# Altium schematic sheet 4_Channel_TVS_alternative.SchDoc
size A4; CompanyName: Technische Hochschule Nürnberg Georg Simon Ohm; Organization: UltraZohm; Address1: Kesslerplatz 12; Address2: 90489 Nürnberg; Address3: GERMANY; SheetNumber: 26; SheetTotal: 36; Website: www.ultrazohm.com
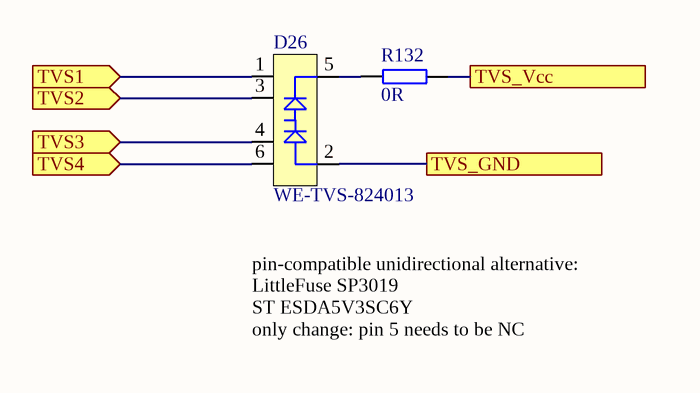
[diagram p0: 4_Channel_TVS_alternative.SchDoc]

## Parts
D26  WE-TVS-824013  [SOT95P280X145-6N]
R132  0R  [RESC1608X55N_V]

## Ports
TVS1 (in), TVS2 (in), TVS3 (in), TVS4 (in), TVS_GND, TVS_Vcc

## Nets
TVS1: D26.1(I/O1) ; port TVS1
TVS2: D26.3(I/O2) ; port TVS2
TVS3: D26.4(I/O3) ; port TVS3
TVS4: D26.6(I/O4) ; port TVS4
TVS_GND: D26.2(GND) ; port TVS_GND
TVS_Vcc: R132.1 ; port TVS_Vcc
NetD26_5: D26.5(VDD) R132.2

## Notes on the sheet
- pin-compatible unidirectional alternative:
  LittleFuse SP3019
  ST ESDA5V3SC6Y
  only change: pin 5 needs to be NC
- Title
- Revision:
- Design Engineer:
- Date:
- Project:
- Sheet
- of

## Library data of the parts
D26 = 23986: TVS/Clamp Diode Array 3.3/9V Quad SOT23-6; AN: 23986; Mixed: SMT; Trenz-Stock: Yes; H-ART: 824013; Extra: ESD Protection for 4 lines, Low capacitance; Case: SOT23-6; HelpURL: B:\AD\adlib\datasheet\WE-TVS-824013; Preferred: Yes
R132 = 21491: WID SMD 0R 0,1W 1% TK100  BF 1608 (0603); Value: 0; AN: 21491; Mixed: SMT; Tolerance: 1%; Case: 1608 (0603); Technology: TK100